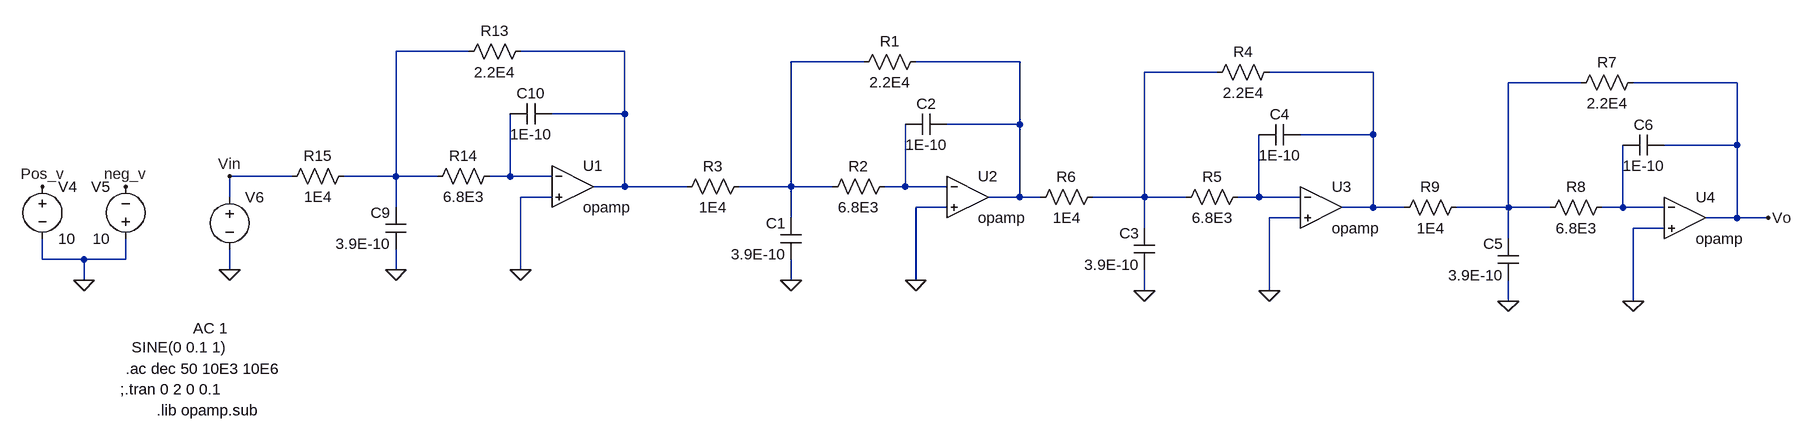
[diagram p0: schematic Cascade E6.asc]
Cascade E6.asc, the LTspice schematic file:
Version 4
SHEET 1 2624 680
WIRE 576 -448 464 -448
WIRE 816 -448 656 -448
WIRE 1184 -432 1072 -432
WIRE 1424 -432 1264 -432
WIRE 1728 -416 1616 -416
WIRE 1968 -416 1808 -416
WIRE 2288 -400 2176 -400
WIRE 2528 -400 2368 -400
WIRE 816 -352 816 -448
WIRE 816 -352 704 -352
WIRE 1424 -336 1424 -432
WIRE 1424 -336 1312 -336
WIRE 1968 -320 1968 -416
WIRE 1968 -320 1856 -320
WIRE 2528 -304 2528 -400
WIRE 2528 -304 2416 -304
WIRE 304 -256 208 -256
WIRE 464 -256 464 -448
WIRE 464 -256 384 -256
WIRE 528 -256 464 -256
WIRE 640 -256 640 -352
WIRE 640 -256 608 -256
WIRE 704 -256 640 -256
WIRE 816 -240 816 -352
WIRE 816 -240 768 -240
WIRE 912 -240 816 -240
WIRE 1072 -240 1072 -432
WIRE 1072 -240 992 -240
WIRE 1136 -240 1072 -240
WIRE 1248 -240 1248 -336
WIRE 1248 -240 1216 -240
WIRE 1312 -240 1248 -240
WIRE 208 -224 208 -256
WIRE 704 -224 656 -224
WIRE 1424 -224 1424 -336
WIRE 1424 -224 1376 -224
WIRE 1456 -224 1424 -224
WIRE 1616 -224 1616 -416
WIRE 1616 -224 1536 -224
WIRE 1680 -224 1616 -224
WIRE 1792 -224 1792 -320
WIRE 1792 -224 1760 -224
WIRE 1856 -224 1792 -224
WIRE 464 -208 464 -256
WIRE 1312 -208 1264 -208
WIRE 1968 -208 1968 -320
WIRE 1968 -208 1920 -208
WIRE 2016 -208 1968 -208
WIRE 2176 -208 2176 -400
WIRE 2176 -208 2096 -208
WIRE 2240 -208 2176 -208
WIRE 2352 -208 2352 -304
WIRE 2352 -208 2320 -208
WIRE 2416 -208 2352 -208
WIRE 1072 -192 1072 -240
WIRE 1856 -192 1808 -192
WIRE 2528 -192 2528 -304
WIRE 2528 -192 2480 -192
WIRE 2576 -192 2528 -192
WIRE 1616 -176 1616 -224
WIRE 2416 -176 2368 -176
WIRE 2176 -160 2176 -208
WIRE -80 -128 -80 -160
WIRE -16 -128 -80 -128
WIRE 48 -128 48 -160
WIRE 48 -128 -16 -128
WIRE 208 -112 208 -144
WIRE 464 -112 464 -144
WIRE 656 -112 656 -224
WIRE -16 -96 -16 -128
WIRE 1072 -96 1072 -128
WIRE 1264 -96 1264 -208
WIRE 1616 -80 1616 -112
WIRE 1808 -80 1808 -192
WIRE 2176 -64 2176 -96
WIRE 2368 -64 2368 -176
FLAG -80 -240 Pos_v
FLAG 48 -240 neg_v
FLAG -16 -96 0
FLAG 656 -112 0
FLAG 464 -112 0
FLAG 208 -112 0
FLAG 208 -256 Vin
FLAG 1264 -96 0
FLAG 1072 -96 0
FLAG 1808 -80 0
FLAG 1616 -80 0
FLAG 2368 -64 0
FLAG 2176 -64 0
FLAG 2576 -192 Vo
SYMBOL voltage -80 -256 R0
WINDOW 123 0 0 Left 0
WINDOW 39 0 0 Left 0
SYMATTR InstName V4
SYMATTR Value 10
SYMBOL voltage 48 -144 R180
WINDOW 0 24 96 Left 2
WINDOW 3 24 16 Left 2
SYMATTR InstName V5
SYMATTR Value 10
SYMBOL res 672 -464 R90
WINDOW 0 0 56 VBottom 2
WINDOW 3 32 56 VTop 2
SYMATTR InstName R13
SYMATTR Value 2.2E4
SYMBOL res 624 -272 R90
WINDOW 0 0 56 VBottom 2
WINDOW 3 32 56 VTop 2
SYMATTR InstName R14
SYMATTR Value 6.8E3
SYMBOL res 400 -272 R90
WINDOW 0 0 56 VBottom 2
WINDOW 3 32 56 VTop 2
SYMATTR InstName R15
SYMATTR Value 1E4
SYMBOL cap 480 -144 R180
WINDOW 0 24 56 Left 2
WINDOW 3 24 8 Left 2
SYMATTR InstName C9
SYMATTR Value 3.9E-10
SYMBOL cap 640 -336 R270
WINDOW 0 32 32 VTop 2
WINDOW 3 0 32 VBottom 2
SYMATTR InstName C10
SYMATTR Value 1E-10
SYMBOL voltage 208 -240 R0
WINDOW 123 -56 218 Left 2
WINDOW 39 0 0 Left 0
WINDOW 3 -151 247 Left 2
SYMATTR Value2 AC 1
SYMATTR Value SINE(0 0.1 1)
SYMATTR InstName V6
SYMBOL res 1280 -448 R90
WINDOW 0 0 56 VBottom 2
WINDOW 3 32 56 VTop 2
SYMATTR InstName R1
SYMATTR Value 2.2E4
SYMBOL res 1232 -256 R90
WINDOW 0 0 56 VBottom 2
WINDOW 3 32 56 VTop 2
SYMATTR InstName R2
SYMATTR Value 6.8E3
SYMBOL res 1008 -256 R90
WINDOW 0 0 56 VBottom 2
WINDOW 3 32 56 VTop 2
SYMATTR InstName R3
SYMATTR Value 1E4
SYMBOL cap 1088 -128 R180
WINDOW 0 24 56 Left 2
WINDOW 3 24 8 Left 2
SYMATTR InstName C1
SYMATTR Value 3.9E-10
SYMBOL cap 1248 -320 R270
WINDOW 0 32 32 VTop 2
WINDOW 3 0 32 VBottom 2
SYMATTR InstName C2
SYMATTR Value 1E-10
SYMBOL res 1824 -432 R90
WINDOW 0 0 56 VBottom 2
WINDOW 3 32 56 VTop 2
SYMATTR InstName R4
SYMATTR Value 2.2E4
SYMBOL res 1776 -240 R90
WINDOW 0 0 56 VBottom 2
WINDOW 3 32 56 VTop 2
SYMATTR InstName R5
SYMATTR Value 6.8E3
SYMBOL res 1552 -240 R90
WINDOW 0 0 56 VBottom 2
WINDOW 3 32 56 VTop 2
SYMATTR InstName R6
SYMATTR Value 1E4
SYMBOL cap 1632 -112 R180
WINDOW 0 24 56 Left 2
WINDOW 3 24 8 Left 2
SYMATTR InstName C3
SYMATTR Value 3.9E-10
SYMBOL cap 1792 -304 R270
WINDOW 0 32 32 VTop 2
WINDOW 3 0 32 VBottom 2
SYMATTR InstName C4
SYMATTR Value 1E-10
SYMBOL res 2384 -416 R90
WINDOW 0 0 56 VBottom 2
WINDOW 3 32 56 VTop 2
SYMATTR InstName R7
SYMATTR Value 2.2E4
SYMBOL res 2336 -224 R90
WINDOW 0 0 56 VBottom 2
WINDOW 3 32 56 VTop 2
SYMATTR InstName R8
SYMATTR Value 6.8E3
SYMBOL res 2112 -224 R90
WINDOW 0 0 56 VBottom 2
WINDOW 3 32 56 VTop 2
SYMATTR InstName R9
SYMATTR Value 1E4
SYMBOL cap 2192 -96 R180
WINDOW 0 24 56 Left 2
WINDOW 3 24 8 Left 2
SYMATTR InstName C5
SYMATTR Value 3.9E-10
SYMBOL cap 2352 -288 R270
WINDOW 0 32 32 VTop 2
WINDOW 3 0 32 VBottom 2
SYMATTR InstName C6
SYMATTR Value 1E-10
SYMBOL Opamps\\opamp 736 -304 R0
SYMATTR InstName U1
SYMBOL Opamps\\opamp 1344 -288 R0
SYMATTR InstName U2
SYMBOL Opamps\\opamp 1888 -272 R0
SYMATTR InstName U3
SYMBOL Opamps\\opamp 2448 -256 R0
SYMATTR InstName U4
TEXT 48 40 Left 2 !.ac dec 50 10E3 10E6
TEXT 40 72 Left 2 !;.tran 0 2 0 0.1
TEXT 96 104 Left 2 !.lib opamp.sub

The netlist it stands for:
* Cascade E6.asc
V4 Pos_v 0 10
V5 0 neg_v 10
R13 N002 N001 2.2E4
R14 N008 N001 6.8E3
R15 N001 Vin 1E4
C9 0 N001 3.9E-10
C10 N008 N002 1E-10
V6 Vin 0 SINE(0 0.1 1) AC 1
R1 N004 N003 2.2E4
R2 N009 N003 6.8E3
R3 N003 N002 1E4
C1 0 N003 3.9E-10
C2 N009 N004 1E-10
R4 N006 N005 2.2E4
R5 N010 N005 6.8E3
R6 N005 N004 1E4
C3 0 N005 3.9E-10
C4 N010 N006 1E-10
R7 Vo N007 2.2E4
R8 N011 N007 6.8E3
R9 N007 N006 1E4
C5 0 N007 3.9E-10
C6 N011 Vo 1E-10
XU1 N008 0 N002 opamp Aol=100K GBW=10Meg  ; pins invin noninvin out
XU2 N009 0 N004 opamp Aol=100K GBW=10Meg  ; pins invin noninvin out
XU3 N010 0 N006 opamp Aol=100K GBW=10Meg  ; pins invin noninvin out
XU4 N011 0 Vo opamp Aol=100K GBW=10Meg  ; pins invin noninvin out
.ac dec 50 10E3 10E6
;.tran 0 2 0 0.1
.lib opamp.sub
.backanno
.end

* Results of the author's LTspice run, read from the files saved beside the schematic
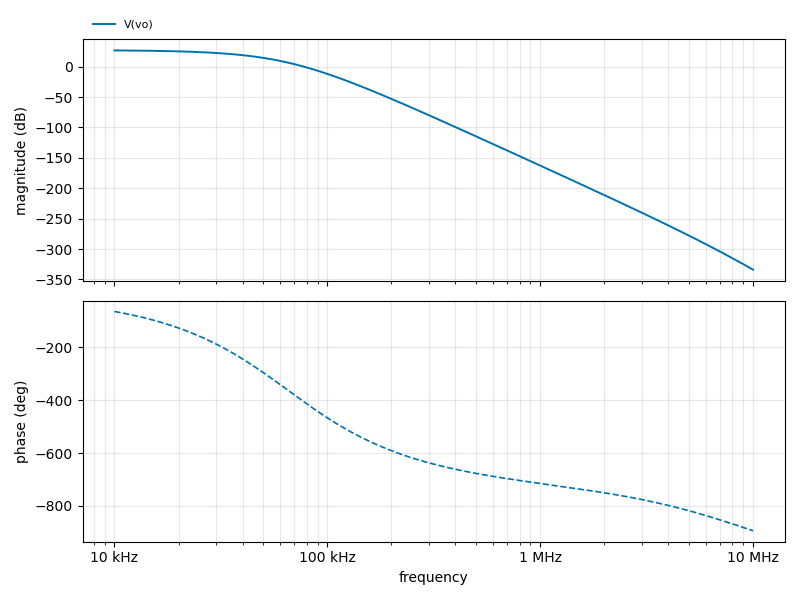
[diagram p1: AC Analysis of Cascade E6.asc, plotted from the saved traces]
* AC Analysis, 1 run:
*   V(vo): 26.88 dB at 10 kHz, -334.05 dB at 10 MHz, peak 26.88 dB at 10 kHz, 3 dB below the peak at 25.94 kHz